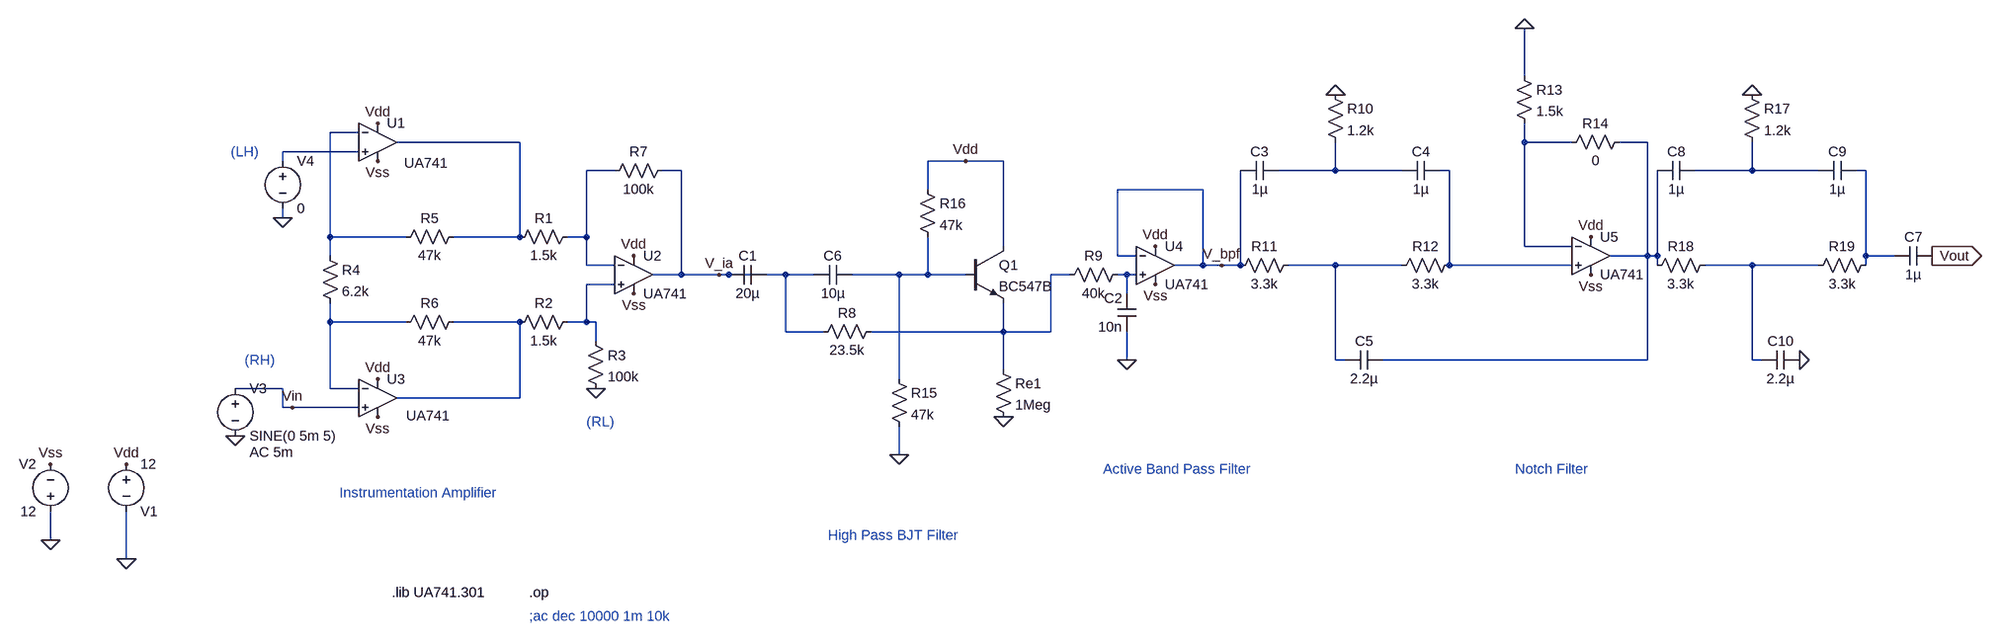
[diagram p0: schematic ecg_final.asc]
ecg_final.asc, the LTspice schematic file:
Version 4
SHEET 1 3264 1320
WIRE 1280 -112 1280 -192
WIRE -720 -16 -768 -16
WIRE -448 0 -656 0
WIRE 1280 0 1280 -32
WIRE 1360 0 1280 0
WIRE 1488 0 1440 0
WIRE -720 16 -848 16
WIRE -848 32 -848 16
WIRE 304 32 240 32
WIRE 368 32 304 32
WIRE -288 48 -336 48
WIRE -176 48 -208 48
WIRE 928 48 928 0
WIRE 928 48 832 48
WIRE 1040 48 928 48
WIRE 1120 48 1104 48
WIRE 1664 48 1664 0
WIRE 1664 48 1568 48
WIRE 1776 48 1664 48
WIRE 1856 48 1840 48
WIRE 240 80 240 32
WIRE 704 80 560 80
WIRE -848 128 -848 112
WIRE -768 160 -768 -16
WIRE -640 160 -768 160
WIRE -448 160 -448 0
WIRE -448 160 -560 160
WIRE -336 160 -336 48
WIRE -336 160 -368 160
WIRE 368 176 368 32
WIRE 1280 176 1280 0
WIRE 1360 176 1280 176
WIRE -768 192 -768 160
WIRE 560 192 560 80
WIRE 592 192 560 192
WIRE 1488 192 1488 0
WIRE 1488 192 1424 192
WIRE 1504 192 1504 48
WIRE 1504 192 1488 192
WIRE 1856 192 1856 48
WIRE 1904 192 1856 192
WIRE -336 208 -336 160
WIRE -288 208 -336 208
WIRE 704 208 704 80
WIRE 704 208 656 208
WIRE 736 208 704 208
WIRE 768 208 768 48
WIRE 768 208 736 208
WIRE 928 208 848 208
WIRE 1040 208 928 208
WIRE 1120 208 1120 48
WIRE 1360 208 1120 208
WIRE 1504 208 1504 192
WIRE 1664 208 1584 208
WIRE 1776 208 1664 208
WIRE 1856 208 1856 192
WIRE -176 224 -176 48
WIRE -176 224 -224 224
WIRE -112 224 -176 224
WIRE -96 224 -112 224
WIRE -48 224 -96 224
WIRE 0 224 -32 224
WIRE 48 224 0 224
WIRE 192 224 112 224
WIRE 240 224 240 160
WIRE 240 224 192 224
WIRE 304 224 240 224
WIRE 480 224 448 224
WIRE 576 224 560 224
WIRE 592 224 576 224
WIRE -288 240 -336 240
WIRE 576 256 576 224
WIRE -768 304 -768 272
WIRE -640 304 -768 304
WIRE -448 304 -560 304
WIRE -336 304 -336 240
WIRE -336 304 -368 304
WIRE -320 304 -336 304
WIRE 0 320 0 224
WIRE 64 320 0 320
WIRE 368 320 368 272
WIRE 368 320 144 320
WIRE 448 320 448 224
WIRE 448 320 368 320
WIRE -320 336 -320 304
WIRE 576 368 576 320
WIRE 928 368 928 208
WIRE 944 368 928 368
WIRE 1488 368 1488 192
WIRE 1488 368 1008 368
WIRE 1664 368 1664 208
WIRE 1680 368 1664 368
WIRE 368 384 368 320
WIRE 192 400 192 224
WIRE -848 416 -928 416
WIRE -768 416 -768 304
WIRE -720 416 -768 416
WIRE -448 432 -448 304
WIRE -448 432 -656 432
WIRE -848 448 -848 416
WIRE -832 448 -848 448
WIRE -720 448 -832 448
WIRE 192 528 192 480
WIRE -1440 672 -1440 624
WIRE -1312 704 -1312 624
FLAG -1440 672 0
FLAG -1312 704 0
FLAG -1440 544 Vss
FLAG -1312 544 Vdd
FLAG -688 400 Vdd
FLAG -688 -32 Vdd
FLAG -688 32 Vss
FLAG -688 464 Vss
FLAG -928 496 0
FLAG -256 192 Vdd
FLAG -256 256 Vss
FLAG -320 416 0
FLAG 624 176 Vdd
FLAG 624 240 Vss
FLAG 928 -80 0
FLAG 1392 160 Vdd
FLAG 1392 224 Vss
FLAG 1280 -192 0
FLAG 736 208 V_bpf
FLAG -112 224 V_ia
FLAG -832 448 Vin
FLAG -848 128 0
FLAG 576 368 0
FLAG 192 528 0
FLAG 368 464 0
FLAG 304 32 Vdd
FLAG 1968 192 Vout
IOPIN 1968 192 Out
FLAG 1664 -80 0
FLAG 1744 368 0
SYMBOL voltage -1312 528 R0
WINDOW 0 24 96 Left 2
WINDOW 3 24 16 Left 2
WINDOW 123 0 0 Left 0
WINDOW 39 0 0 Left 0
SYMATTR InstName V1
SYMATTR Value 12
SYMBOL voltage -1440 640 R180
WINDOW 0 24 96 Left 2
WINDOW 3 24 16 Left 2
WINDOW 123 0 0 Left 0
WINDOW 39 0 0 Left 0
SYMATTR InstName V2
SYMATTR Value 12
SYMBOL res -784 176 R0
SYMATTR InstName R4
SYMATTR Value 6.2k
SYMBOL res -544 144 R90
WINDOW 0 0 56 VBottom 2
WINDOW 3 32 56 VTop 2
SYMATTR InstName R5
SYMATTR Value 47k
SYMBOL res -544 288 R90
WINDOW 0 0 56 VBottom 2
WINDOW 3 32 56 VTop 2
SYMATTR InstName R6
SYMATTR Value 47k
SYMBOL voltage -928 400 R0
WINDOW 123 24 124 Left 2
WINDOW 39 0 0 Left 0
SYMATTR Value2 AC 5m
SYMATTR InstName V3
SYMATTR Value SINE(0 5m 5)
SYMBOL OpAmps\\opamp2 -688 -64 R0
WINDOW 3 45 99 Left 2
SYMATTR Value UA741
SYMATTR InstName U1
SYMBOL OpAmps\\opamp2 -688 368 R0
WINDOW 3 48 94 Left 2
SYMATTR Value UA741
SYMATTR InstName U3
SYMBOL OpAmps\\opamp2 -256 160 R0
SYMATTR InstName U2
SYMATTR Value UA741
SYMBOL res -352 144 R90
WINDOW 0 0 56 VBottom 2
WINDOW 3 32 56 VTop 2
SYMATTR InstName R1
SYMATTR Value 1.5k
SYMBOL res -352 288 R90
WINDOW 0 0 56 VBottom 2
WINDOW 3 32 56 VTop 2
SYMATTR InstName R2
SYMATTR Value 1.5k
SYMBOL res -336 320 R0
SYMATTR InstName R3
SYMATTR Value 100k
SYMBOL res -192 32 R90
WINDOW 0 0 56 VBottom 2
WINDOW 3 32 56 VTop 2
SYMATTR InstName R7
SYMATTR Value 100k
SYMBOL OpAmps\\opamp2 624 144 R0
SYMATTR InstName U4
SYMATTR Value UA741
SYMBOL cap 592 320 R180
WINDOW 0 24 56 Left 2
WINDOW 3 24 8 Left 2
SYMATTR InstName C2
SYMATTR Value 10n
SYMBOL res 576 208 R90
WINDOW 0 0 56 VBottom 2
WINDOW 3 32 56 VTop 2
SYMATTR InstName R9
SYMATTR Value 40k
SYMBOL cap 832 32 R90
WINDOW 0 0 32 VBottom 2
WINDOW 3 32 32 VTop 2
SYMATTR InstName C3
SYMATTR Value 1µ
SYMBOL cap 1104 32 R90
WINDOW 0 0 32 VBottom 2
WINDOW 3 32 32 VTop 2
SYMATTR InstName C4
SYMATTR Value 1µ
SYMBOL res 912 -96 R0
SYMATTR InstName R10
SYMATTR Value 1.2k
SYMBOL res 864 192 R90
WINDOW 0 0 56 VBottom 2
WINDOW 3 32 56 VTop 2
SYMATTR InstName R11
SYMATTR Value 3.3k
SYMBOL res 1136 192 R90
WINDOW 0 0 56 VBottom 2
WINDOW 3 32 56 VTop 2
SYMATTR InstName R12
SYMATTR Value 3.3k
SYMBOL OpAmps\\opamp2 1392 128 R0
SYMATTR InstName U5
SYMATTR Value UA741
SYMBOL cap 1008 352 R90
WINDOW 0 0 32 VBottom 2
WINDOW 3 32 32 VTop 2
SYMATTR InstName C5
SYMATTR Value 2.2µ
SYMBOL res 1264 -128 R0
SYMATTR InstName R13
SYMATTR Value 1.5k
SYMBOL res 1456 -16 R90
WINDOW 0 0 56 VBottom 2
WINDOW 3 32 56 VTop 2
SYMATTR InstName R14
SYMATTR Value 0
SYMBOL voltage -848 16 R0
WINDOW 123 0 0 Left 0
WINDOW 39 0 0 Left 0
SYMATTR InstName V4
SYMATTR Value 0
SYMBOL cap -32 208 R90
WINDOW 0 0 32 VBottom 2
WINDOW 3 32 32 VTop 2
SYMATTR InstName C1
SYMATTR Value 20µ
SYMBOL cap 112 208 R90
WINDOW 0 0 32 VBottom 2
WINDOW 3 32 32 VTop 2
SYMATTR InstName C6
SYMATTR Value 10µ
SYMBOL res 160 304 R90
WINDOW 0 0 56 VBottom 2
WINDOW 3 32 56 VTop 2
SYMATTR InstName R8
SYMATTR Value 23.5k
SYMBOL res 176 384 R0
SYMATTR InstName R15
SYMATTR Value 47k
SYMBOL res 224 64 R0
SYMATTR InstName R16
SYMATTR Value 47k
SYMBOL npn 304 176 R0
SYMATTR InstName Q1
SYMATTR Value BC547B
SYMBOL res 352 368 R0
SYMATTR InstName Re1
SYMATTR Value 1Meg
SYMBOL cap 1968 176 R90
WINDOW 0 0 32 VBottom 2
WINDOW 3 32 32 VTop 2
SYMATTR InstName C7
SYMATTR Value 1µ
SYMBOL cap 1568 32 R90
WINDOW 0 0 32 VBottom 2
WINDOW 3 32 32 VTop 2
SYMATTR InstName C8
SYMATTR Value 1µ
SYMBOL cap 1840 32 R90
WINDOW 0 0 32 VBottom 2
WINDOW 3 32 32 VTop 2
SYMATTR InstName C9
SYMATTR Value 1µ
SYMBOL res 1648 -96 R0
SYMATTR InstName R17
SYMATTR Value 1.2k
SYMBOL res 1600 192 R90
WINDOW 0 0 56 VBottom 2
WINDOW 3 32 56 VTop 2
SYMATTR InstName R18
SYMATTR Value 3.3k
SYMBOL res 1872 192 R90
WINDOW 0 0 56 VBottom 2
WINDOW 3 32 56 VTop 2
SYMATTR InstName R19
SYMATTR Value 3.3k
SYMBOL cap 1744 352 R90
WINDOW 0 0 32 VBottom 2
WINDOW 3 32 32 VTop 2
SYMATTR InstName C10
SYMATTR Value 2.2µ
TEXT -432 760 Left 2 !.op
TEXT -664 760 Left 2 !.lib UA741.301
TEXT -752 592 Left 2 ;Instrumentation Amplifier
TEXT -912 368 Left 2 ;(RH)
TEXT -936 16 Left 2 ;(LH)
TEXT -336 472 Left 2 ;(RL)
TEXT 536 552 Left 2 ;Active Band Pass Filter
TEXT 1264 552 Left 2 ;Notch Filter
TEXT -432 800 Left 2 ;;ac dec 10000 1m 10k
TEXT 72 664 Left 2 ;High Pass BJT Filter

The netlist it stands for:
* ecg_final.asc
V1 Vdd 0 12
V2 0 Vss 12
R4 N001 N018 6.2k
R5 N002 N001 47k
R6 N019 N018 47k
V3 Vin 0 SINE(0 5m 5) AC 5m
XU1 N005 N001 Vdd Vss N002 UA741  ; pins In+ In- V+ V- OUT
XU3 Vin N018 Vdd Vss N019 UA741  ; pins In+ In- V+ V- OUT
XU2 N017 N006 Vdd Vss V_ia UA741  ; pins In+ In- V+ V- OUT
R1 N006 N002 1.5k
R2 N017 N019 1.5k
R3 N017 0 100k
R7 V_ia N006 100k
XU4 N016 V_bpf Vdd Vss V_bpf UA741  ; pins In+ In- V+ V- OUT
C2 0 N016 10n
R9 N016 N015 40k
C3 N007 V_bpf 1µ
C4 N008 N007 1µ
R10 0 N007 1.2k
R11 N011 V_bpf 3.3k
R12 N008 N011 3.3k
XU5 N008 N003 Vdd Vss N004 UA741  ; pins In+ In- V+ V- OUT
C5 N004 N011 2.2µ
R13 0 N003 1.5k
R14 N004 N003 0
V4 N005 0 0
C1 N013 V_ia 20µ
C6 N014 N013 10µ
R8 N015 N013 23.5k
R15 N014 0 47k
R16 Vdd N014 47k
Q1 Vdd N014 N015 0 BC547B
Re1 N015 0 1Meg
C7 Vout N010 1µ
C8 N009 N004 1µ
C9 N010 N009 1µ
R17 0 N009 1.2k
R18 N012 N004 3.3k
R19 N010 N012 3.3k
C10 0 N012 2.2µ
.model NPN NPN
.model PNP PNP
.lib standard.bjt
.op
.lib UA741.301
* Instrumentation Amplifier
* (RH)
* (LH)
* (RL)
* Active Band Pass Filter
* Notch Filter
* ;ac dec 10000 1m 10k
* High Pass BJT Filter
.backanno
.end